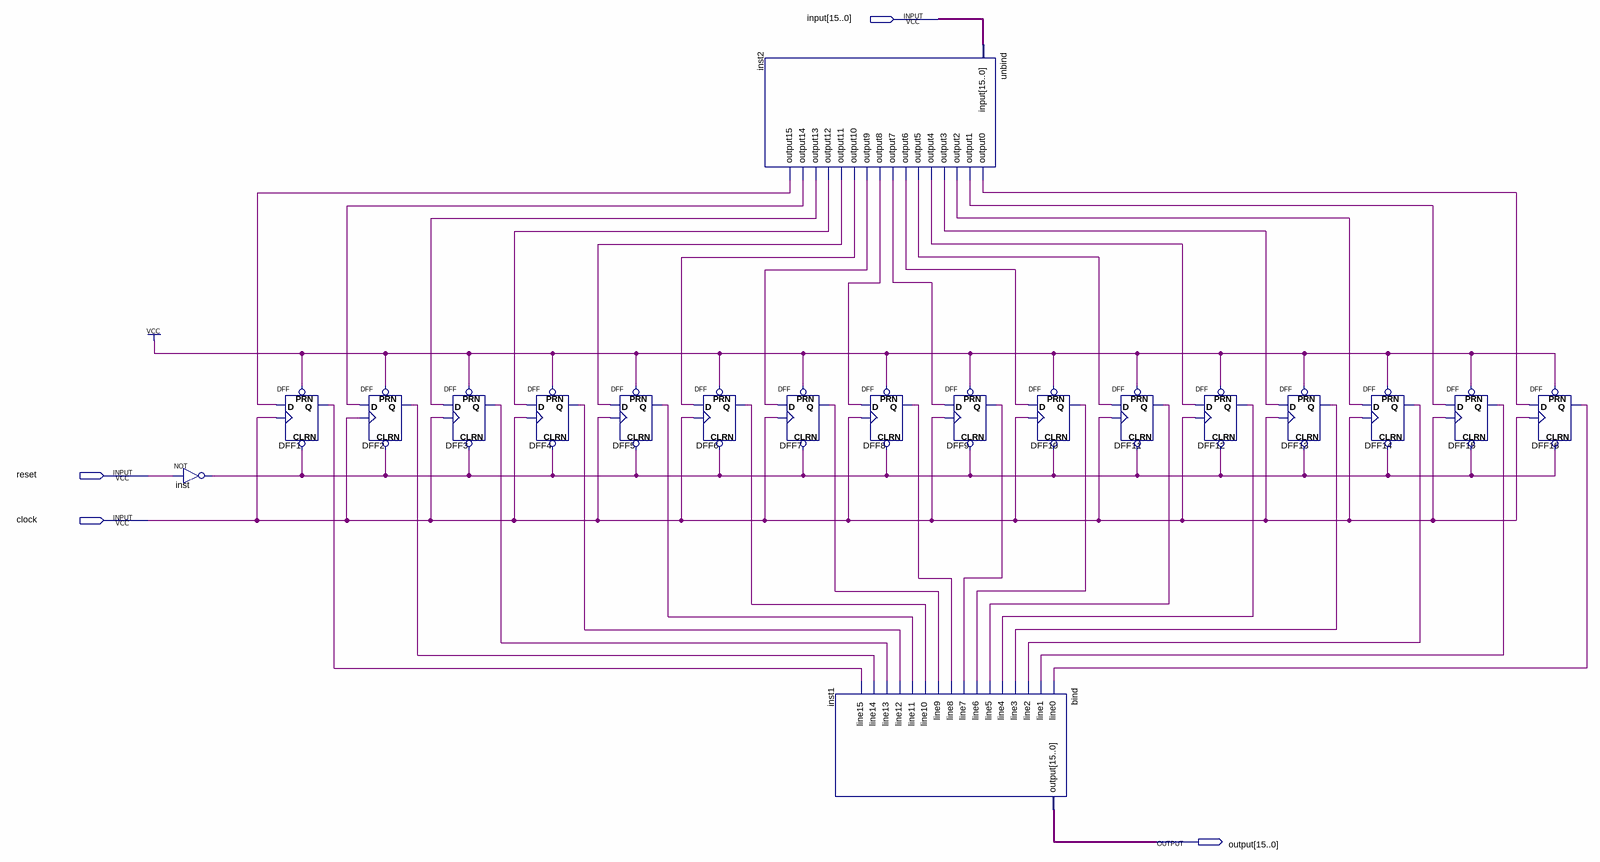
[diagram p0: schematic sheet]
// Quartus schematic 16strage.bdf as structural Verilog: 19 symbols, 4 pins
module \16strage  (
  input  [15:0] \input ,
  input  reset,
  input  clock,
  output [15:0] \output 
);

  wire DFF1_q, DFF2_q, DFF3_q, DFF4_q, DFF5_q, DFF6_q, DFF7_q, DFF8_q, DFF9_q, DFF10_q, DFF11_q, DFF12_q,
       DFF13_q, DFF14_q, DFF15_q, DFF16_q, inst2_output0, inst2_output1, inst2_output2, inst2_output3,
       inst2_output4, inst2_output5, inst2_output6, inst2_output7, inst2_output8, inst2_output9,
       inst2_output10, inst2_output11, inst2_output12, inst2_output13, inst2_output14, inst2_output15,
       inst_out;

  not inst (inst_out, reset);
  DFF DFF1 (.CLRN(inst_out), .CLK(clock), .D(inst2_output15), .PRN(1'b1), .Q(DFF1_q));
  DFF DFF2 (.CLRN(inst_out), .CLK(clock), .D(inst2_output14), .PRN(1'b1), .Q(DFF2_q));
  DFF DFF3 (.CLRN(inst_out), .CLK(clock), .D(inst2_output13), .PRN(1'b1), .Q(DFF3_q));
  DFF DFF4 (.CLRN(inst_out), .CLK(clock), .D(inst2_output12), .PRN(1'b1), .Q(DFF4_q));
  DFF DFF5 (.CLRN(inst_out), .CLK(clock), .D(inst2_output11), .PRN(1'b1), .Q(DFF5_q));
  DFF DFF6 (.CLRN(inst_out), .CLK(clock), .D(inst2_output10), .PRN(1'b1), .Q(DFF6_q));
  unbind inst2 (
    .\input (\input ), .output0(inst2_output0), .output1(inst2_output1), .output2(inst2_output2),
    .output3(inst2_output3), .output4(inst2_output4), .output5(inst2_output5), .output6(inst2_output6),
    .output7(inst2_output7), .output8(inst2_output8), .output9(inst2_output9), .output10(inst2_output10),
    .output11(inst2_output11), .output12(inst2_output12), .output13(inst2_output13),
    .output14(inst2_output14), .output15(inst2_output15));
  DFF DFF7 (.CLRN(inst_out), .CLK(clock), .D(inst2_output9), .PRN(1'b1), .Q(DFF7_q));
  \bind  inst1 (
    .line0(DFF16_q), .line1(DFF15_q), .line2(DFF14_q), .line3(DFF13_q), .line4(DFF12_q), .line5(DFF11_q),
    .line6(DFF10_q), .line7(DFF9_q), .line8(DFF8_q), .line9(DFF7_q), .line10(DFF6_q), .line11(DFF5_q),
    .line12(DFF4_q), .line13(DFF3_q), .line14(DFF2_q), .line15(DFF1_q), .\output (\output ));
  DFF DFF8 (.CLRN(inst_out), .CLK(clock), .D(inst2_output8), .PRN(1'b1), .Q(DFF8_q));
  DFF DFF9 (.CLRN(inst_out), .CLK(clock), .D(inst2_output7), .PRN(1'b1), .Q(DFF9_q));
  DFF DFF10 (.CLRN(inst_out), .CLK(clock), .D(inst2_output6), .PRN(1'b1), .Q(DFF10_q));
  DFF DFF11 (.CLRN(inst_out), .CLK(clock), .D(inst2_output5), .PRN(1'b1), .Q(DFF11_q));
  DFF DFF12 (.CLRN(inst_out), .CLK(clock), .D(inst2_output4), .PRN(1'b1), .Q(DFF12_q));
  DFF DFF13 (.CLRN(inst_out), .CLK(clock), .D(inst2_output3), .PRN(1'b1), .Q(DFF13_q));
  DFF DFF14 (.CLRN(inst_out), .CLK(clock), .D(inst2_output2), .PRN(1'b1), .Q(DFF14_q));
  DFF DFF15 (.CLRN(inst_out), .CLK(clock), .D(inst2_output1), .PRN(1'b1), .Q(DFF15_q));
  DFF DFF16 (.CLRN(inst_out), .CLK(clock), .D(inst2_output0), .PRN(1'b1), .Q(DFF16_q));
endmodule
